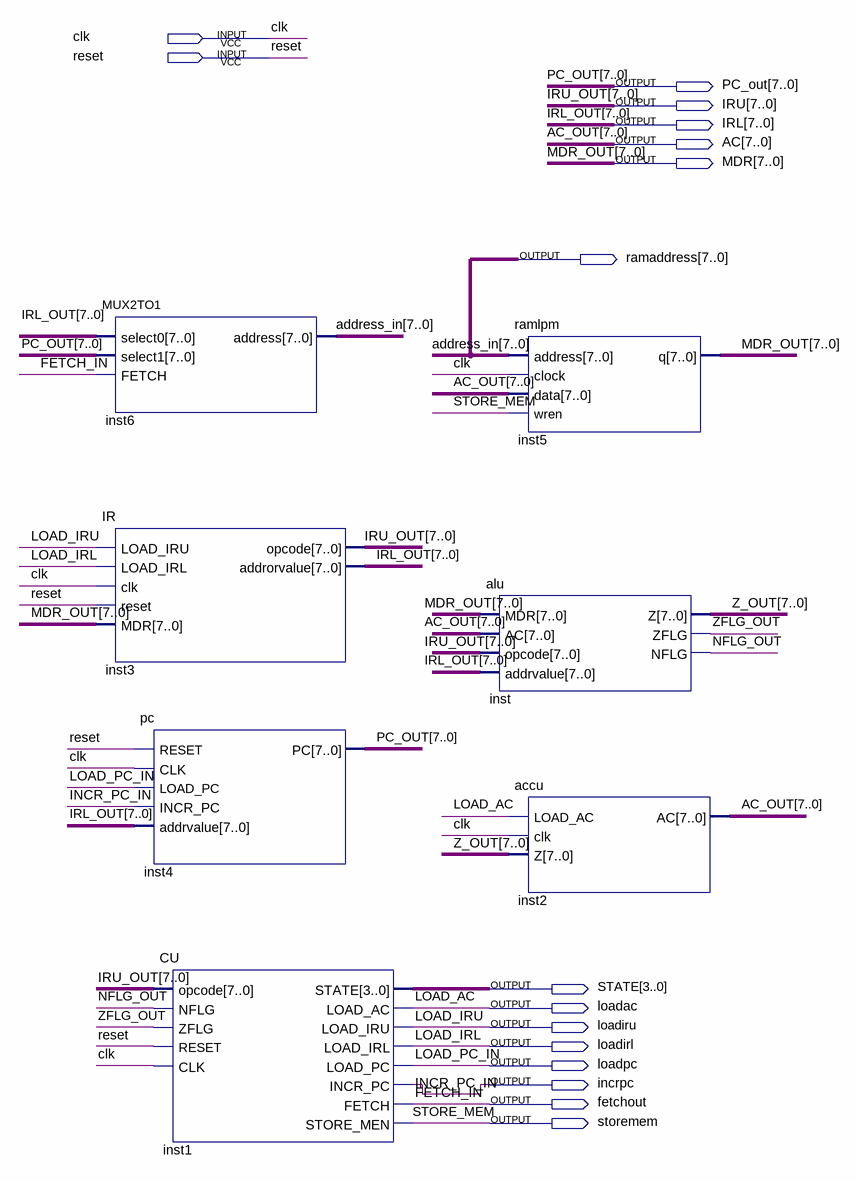
[diagram p0: schematic sheet]
// Quartus schematic MCU.bdf as structural Verilog: 7 symbols, 16 pins
module MCU (
  input  clk,
  input  reset,
  output [7:0] PC_out,
  output [7:0] IRU,
  output [7:0] IRL,
  output [7:0] AC,
  output [7:0] MDR,
  output [7:0] ramaddress,
  output [3:0] STATE,
  output loadac,
  output loadiru,
  output loadirl,
  output loadpc,
  output incrpc,
  output fetchout,
  output storemem
);

  wire NFLG_OUT, ZFLG_OUT;
  wire [7:0] Z_OUT;

  MUX2TO1 inst6 (.select0(IRL), .select1(PC_out), .FETCH(fetchout), .address(ramaddress));
  IR inst3 (
    .LOAD_IRU(loadiru), .LOAD_IRL(loadirl), .clk(clk), .reset(reset), .MDR(MDR), .opcode(IRU),
    .addrorvalue(IRL));
  pc inst4 (.RESET(reset), .CLK(clk), .LOAD_PC(loadpc), .INCR_PC(incrpc), .addrvalue(IRL), .PC(PC_out));
  CU inst1 (
    .opcode(IRU), .NFLG(NFLG_OUT), .ZFLG(ZFLG_OUT), .RESET(reset), .CLK(clk), .STATE(STATE),
    .LOAD_AC(loadac), .LOAD_IRU(loadiru), .LOAD_IRL(loadirl), .LOAD_PC(loadpc), .INCR_PC(incrpc),
    .FETCH(fetchout), .STORE_MEN(storemem));
  ramlpm inst5 (.address(ramaddress), .clock(clk), .data(AC), .wren(storemem), .q(MDR));
  alu inst (.MDR(MDR), .AC(AC), .opcode(IRU), .addrvalue(IRL), .Z(Z_OUT), .ZFLG(ZFLG_OUT), .NFLG(NFLG_OUT));
  accu inst2 (.LOAD_AC(loadac), .clk(clk), .Z(Z_OUT), .AC(AC));

  // Other names for the same wires on the sheet: AC_OUT[7:0] = AC; FETCH_IN = fetchout; INCR_PC_IN = incrpc;
  //   IRL_OUT[7:0] = IRL; IRU_OUT[7:0] = IRU; LOAD_AC = loadac; LOAD_IRL = loadirl; LOAD_IRU = loadiru;
  //   LOAD_PC_IN = loadpc; MDR_OUT[7:0] = MDR; address_in[7:0] = ramaddress; STORE_MEM = storemem
endmodule
